# Altium project HGF_BTN8982TA.PrjPcb
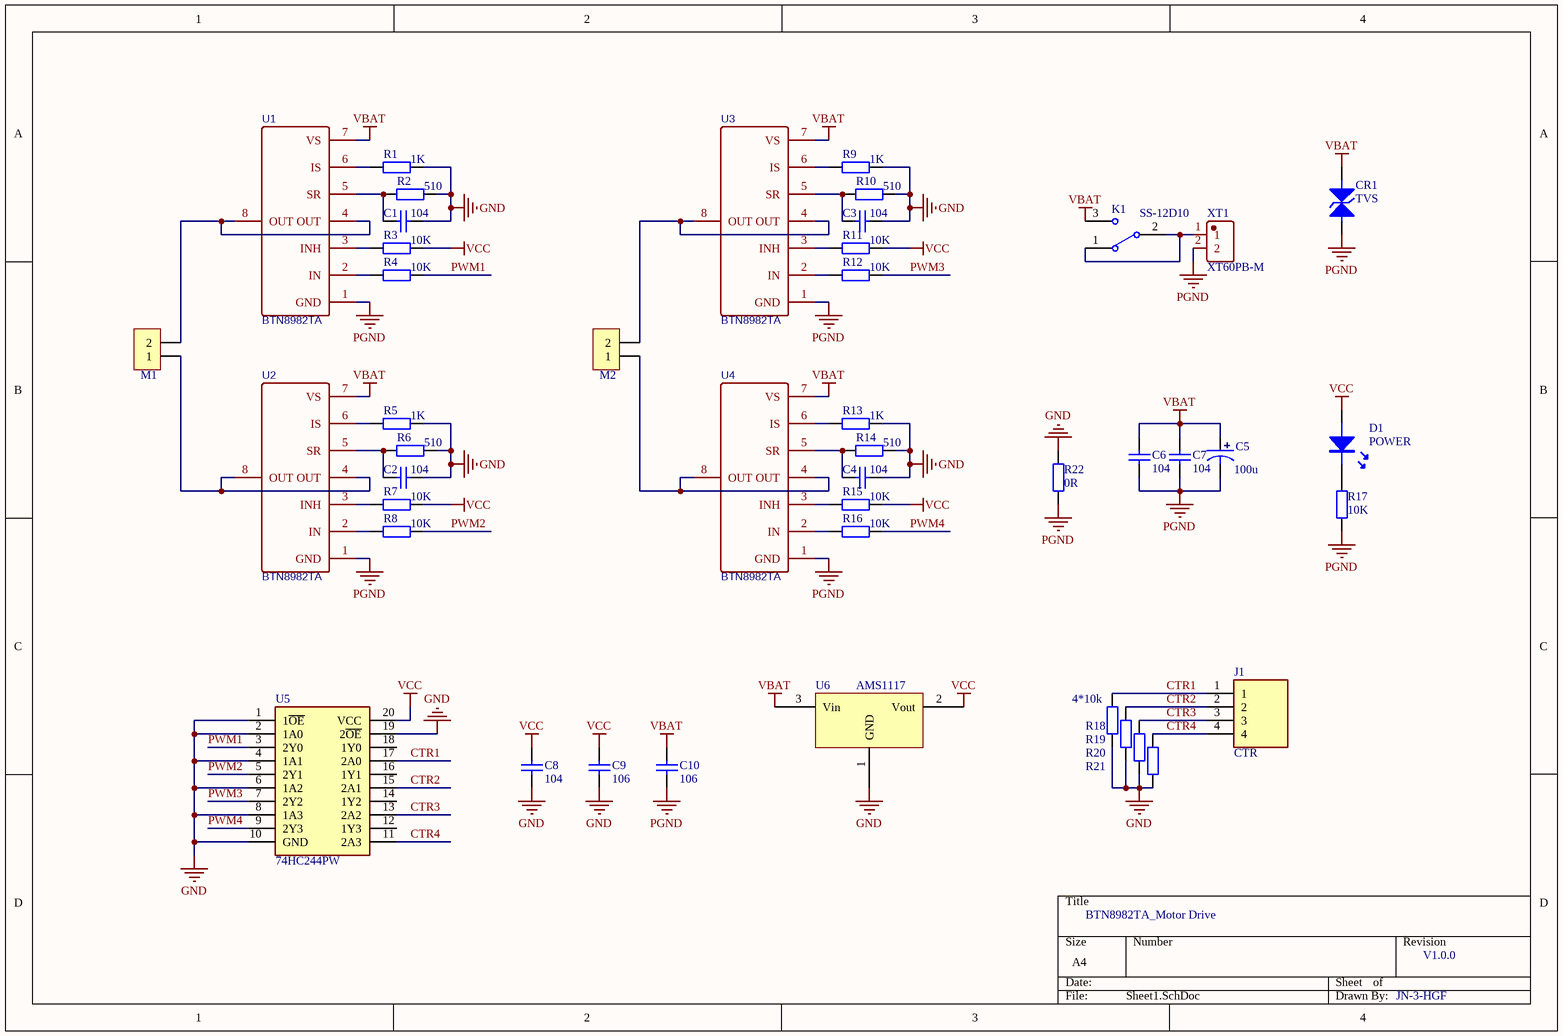
[diagram p0: Sheet1.SchDoc]
1 sheet, 45 parts. Net scope: global (net labels, ports and power ports of the same name join across sheets).
Board file: PCB1.PcbDoc

## Sheet Sheet1.SchDoc
size A4; SheetNumber: 1; SheetTotal: 1

### Parts
C1  value 104  [CAP0603]  (hidden comment: Cap)
C2  value 104  [CAP0603]  (hidden comment: Cap)
C3  value 104  [CAP0603]  (hidden comment: Cap)
C4  value 104  [CAP0603]  (hidden comment: Cap)
C5  100u  [SMD-EC6.3X6.3X10]
C6  value 104  [CAP0603]  (hidden comment: Cap)
C7  value 104  [CAP0603]  (hidden comment: Cap)
C8  value 104  [CAP0603]  (hidden comment: Cap)
C9  value 106  [CAP0603]  (hidden comment: Cap)
C10  value 106  [CAP0603]  (hidden comment: Cap)
CR1  TVS  [SMA/DO-214AC]
D1  POWER  [LED-0603G]
J1  CTR  [XH2.54-LI-4P]
K1  SS-12D10  [SS-12D10]
M1  HDR-1X2  [KF301-5.0-2P]  (value not drawn)
M2  HDR-1X2  [KF301-5.0-2P]  (value not drawn)
R1  value 1K  [R0603]  (hidden comment: Res2)
R2  value 510  [R0603]  (hidden comment: Res2)
R3  value 10K  [R0603]  (hidden comment: Res2)
R4  value 10K  [R0603]  (hidden comment: Res2)
R5  value 1K  [R0603]  (hidden comment: Res2)
R6  value 510  [R0603]  (hidden comment: Res2)
R7  value 10K  [R0603]  (hidden comment: Res2)
R8  value 10K  [R0603]  (hidden comment: Res2)
R9  value 1K  [R0603]  (hidden comment: Res2)
R10  value 510  [R0603]  (hidden comment: Res2)
R11  value 10K  [R0603]  (hidden comment: Res2)
R12  value 10K  [R0603]  (hidden comment: Res2)
R13  value 1K  [R0603]  (hidden comment: Res2)
R14  value 510  [R0603]  (hidden comment: Res2)
R15  value 10K  [R0603]  (hidden comment: Res2)
R16  value 10K  [R0603]  (hidden comment: Res2)
R17  value 10K  [R0603]  (hidden comment: Res2)
R18  Res2  [R0603]  (value not drawn)
R19  Res2  [R0603]  (value not drawn)
R20  Res2  [R0603]  (value not drawn)
R21  Res2  [R0603]  (value not drawn)
R22  value 0R  [R0603]  (hidden comment: Res2)
U1  BTN8982TA  [TO-263-7_L10.2-W10.4-P1.27-LS14.4-BR]
U2  BTN8982TA  [TO-263-7_L10.2-W10.4-P1.27-LS14.4-BR]
U3  BTN8982TA  [TO-263-7_L10.2-W10.4-P1.27-LS14.4-BR]
U4  BTN8982TA  [TO-263-7_L10.2-W10.4-P1.27-LS14.4-BR]
U5  74HC244PW  [SOP65P640X110-20N]
U6  AMS1117  [SOT223_N]
XT1  XT60PB-M  [XT30UPB-M]

### Nets
GND: C1.2 C2.2 C3.2 C4.2 C8.1 C9.1 R1.2 R2.2 R5.2 R6.2 R9.2 R10.2 R13.2 R14.2 R18.1 R19.1 R20.1 R21.1 R22.2 U5.1(1~{OE}) U5.2(1A0) U5.4(1A1) U5.6(1A2) U5.8(1A3) U5.10(GND) U5.19(2~{OE}) U6.1(GND)
PGND: C5.2 C6.1 C7.1 C10.1 CR1.A R17.1 R22.1 U1.1(GND) U2.1(GND) U3.1(GND) U4.1(GND) XT1.2
VBAT: C5.1 C6.2 C7.2 C10.2 CR1.K K1.3 U1.7(VS) U2.7(VS) U3.7(VS) U4.7(VS) U6.3(Vin)
VCC: C8.2 C9.2 D1.A R3.2 R7.2 R11.2 R15.2 U5.20(VCC) U6.2(Vout)
CTR1: J1.1 R18.2 U5.17(2A0)
CTR2: J1.2 R19.2 U5.15(2A1)
CTR3: J1.3 R20.2 U5.13(2A2)
CTR4: J1.4 R21.2 U5.11(2A3)
PWM1: R4.2 U5.3(2Y0)
PWM2: R8.2 U5.5(2Y1)
PWM3: R12.2 U5.7(2Y2)
PWM4: R16.2 U5.9(2Y3)
NetC1_1: C1.1 R2.1 U1.5(SR)
NetC2_1: C2.1 R6.1 U2.5(SR)
NetC3_1: C3.1 R10.1 U3.5(SR)
NetC4_1: C4.1 R14.1 U4.5(SR)
NetD1_K: D1.K R17.2
NetK1_1: K1.1 K1.2 XT1.1
NetM1_1: M1.1 U2.4(OUT) U2.8(OUT)
NetM1_2: M1.2 U1.4(OUT) U1.8(OUT)
NetM2_1: M2.1 U4.4(OUT) U4.8(OUT)
NetM2_2: M2.2 U3.4(OUT) U3.8(OUT)
NetR1_1: R1.1 U1.6(IS)
NetR3_1: R3.1 U1.3(INH)
NetR4_1: R4.1 U1.2(IN)
NetR5_1: R5.1 U2.6(IS)
NetR7_1: R7.1 U2.3(INH)
NetR8_1: R8.1 U2.2(IN)
NetR9_1: R9.1 U3.6(IS)
NetR11_1: R11.1 U3.3(INH)
NetR12_1: R12.1 U3.2(IN)
NetR13_1: R13.1 U4.6(IS)
NetR15_1: R15.1 U4.3(INH)
NetR16_1: R16.1 U4.2(IN)

Not connected (* = marked no-connect by the designer): U5 12(1Y3) 14(1Y2) 16(1Y1) 18(1Y0)

### Notes on the sheet
- (near R18) 4*10k
- BTN8982TA_Motor Drive
- V1.0.0
- JN-3-HGF

### Library data of the parts
C1-C4 C6-C10 = Cap: Capacitor; Published: 8-Jun-2000; LatestRevisionDate: 17-Jul-2002; LatestRevisionNote: Re-released for DXP Platform.; PackageReference: RAD-0.3; Publisher: Altium Limited; PackageDescription: Radial Cap, Thru-Hole; 2 Leads; 0.3 in Pin Spacing
C5 = SMD_ECAP: 贴片电解电容
CR1 = TVS: 双向瞬态抑制二极管
D1 = LED
J1 = B4B-XH-A_LF__SN_: Connector; Manufacturer_Name: JST (JAPAN SOLDERLESS TERMINALS); Manufacturer_Part_Number: B4B-XH-A(LF)(SN); Datasheet Link: https://datasheet.lcsc.com/szlcsc/JST-Sales-America-B4B-XH-A-LF-SN_C144395.pdf; Height: 7mm; Arrow Part Number: B4B-XH-A(LF)(SN); Arrow Price/Stock: https://www.arrow.com/en/products/b4b-xh-a-lf-sn/jst-manufacturing
M1 M2 = Header 2: 2P接插件; 版权归属: 源创客; BOM名称: 2P接插件; 学习资源: www.ooocke.com
R1-R17 R22 = Res2: Resistor; Published: 8-Jun-2000; LatestRevisionDate: 17-Jul-2002; LatestRevisionNote: Re-released for DXP Platform.; PackageReference: AXIAL-0.4; Publisher: Altium Limited; PackageDescription: Axial Device, Thru-Hole; 2 Leads; 0.4 in Pin Spacing
R18-R21 = Res2: Resistor; Value: 10K; Published: 8-Jun-2000; LatestRevisionDate: 17-Jul-2002; LatestRevisionNote: Re-released for DXP Platform.; PackageReference: AXIAL-0.4; Publisher: Altium Limited; PackageDescription: Axial Device, Thru-Hole; 2 Leads; 0.4 in Pin Spacing
U1-U4 = BTN8982TA: BOM_Manufacturer: Infineon; BOM_Manufacturer Part: BTN8982TAAUMA1; BOM_Supplier: LCSC; BOM_Supplier Part: C74175; BOM_JLCPCB Part Class: Extended Part; spicePre: U; spiceSymbolName: BTN8982TAAUMA1
U5 = 74HC244PW: Integrated Circuit; Manufacturer_Name: Nexperia; Datasheet Link: https://assets.nexperia.com/documents/data-sheet/74HC_HCT244.pdf; Height: 1.1mm; Manufacturer_Part_Number: 74HC244PW; Mouser Part Number: 771-74HC244PW; Mouser Price/Stock: https://www.mouser.co.uk/ProductDetail/Nexperia/74HC244PW?qs=JTOGeJziEKFS1HataEekuQ%3D%3D
U6 = AMS1117: 三端稳压芯片